# Altium schematic sheet [02] Arduino.SchDoc: Arduino Uno socket
size B; Engineer: M. Folejewski; DocumentNumber: 2; SheetNumber: 2; SheetTotal: 2; Designators: 1-99; PageSize: B
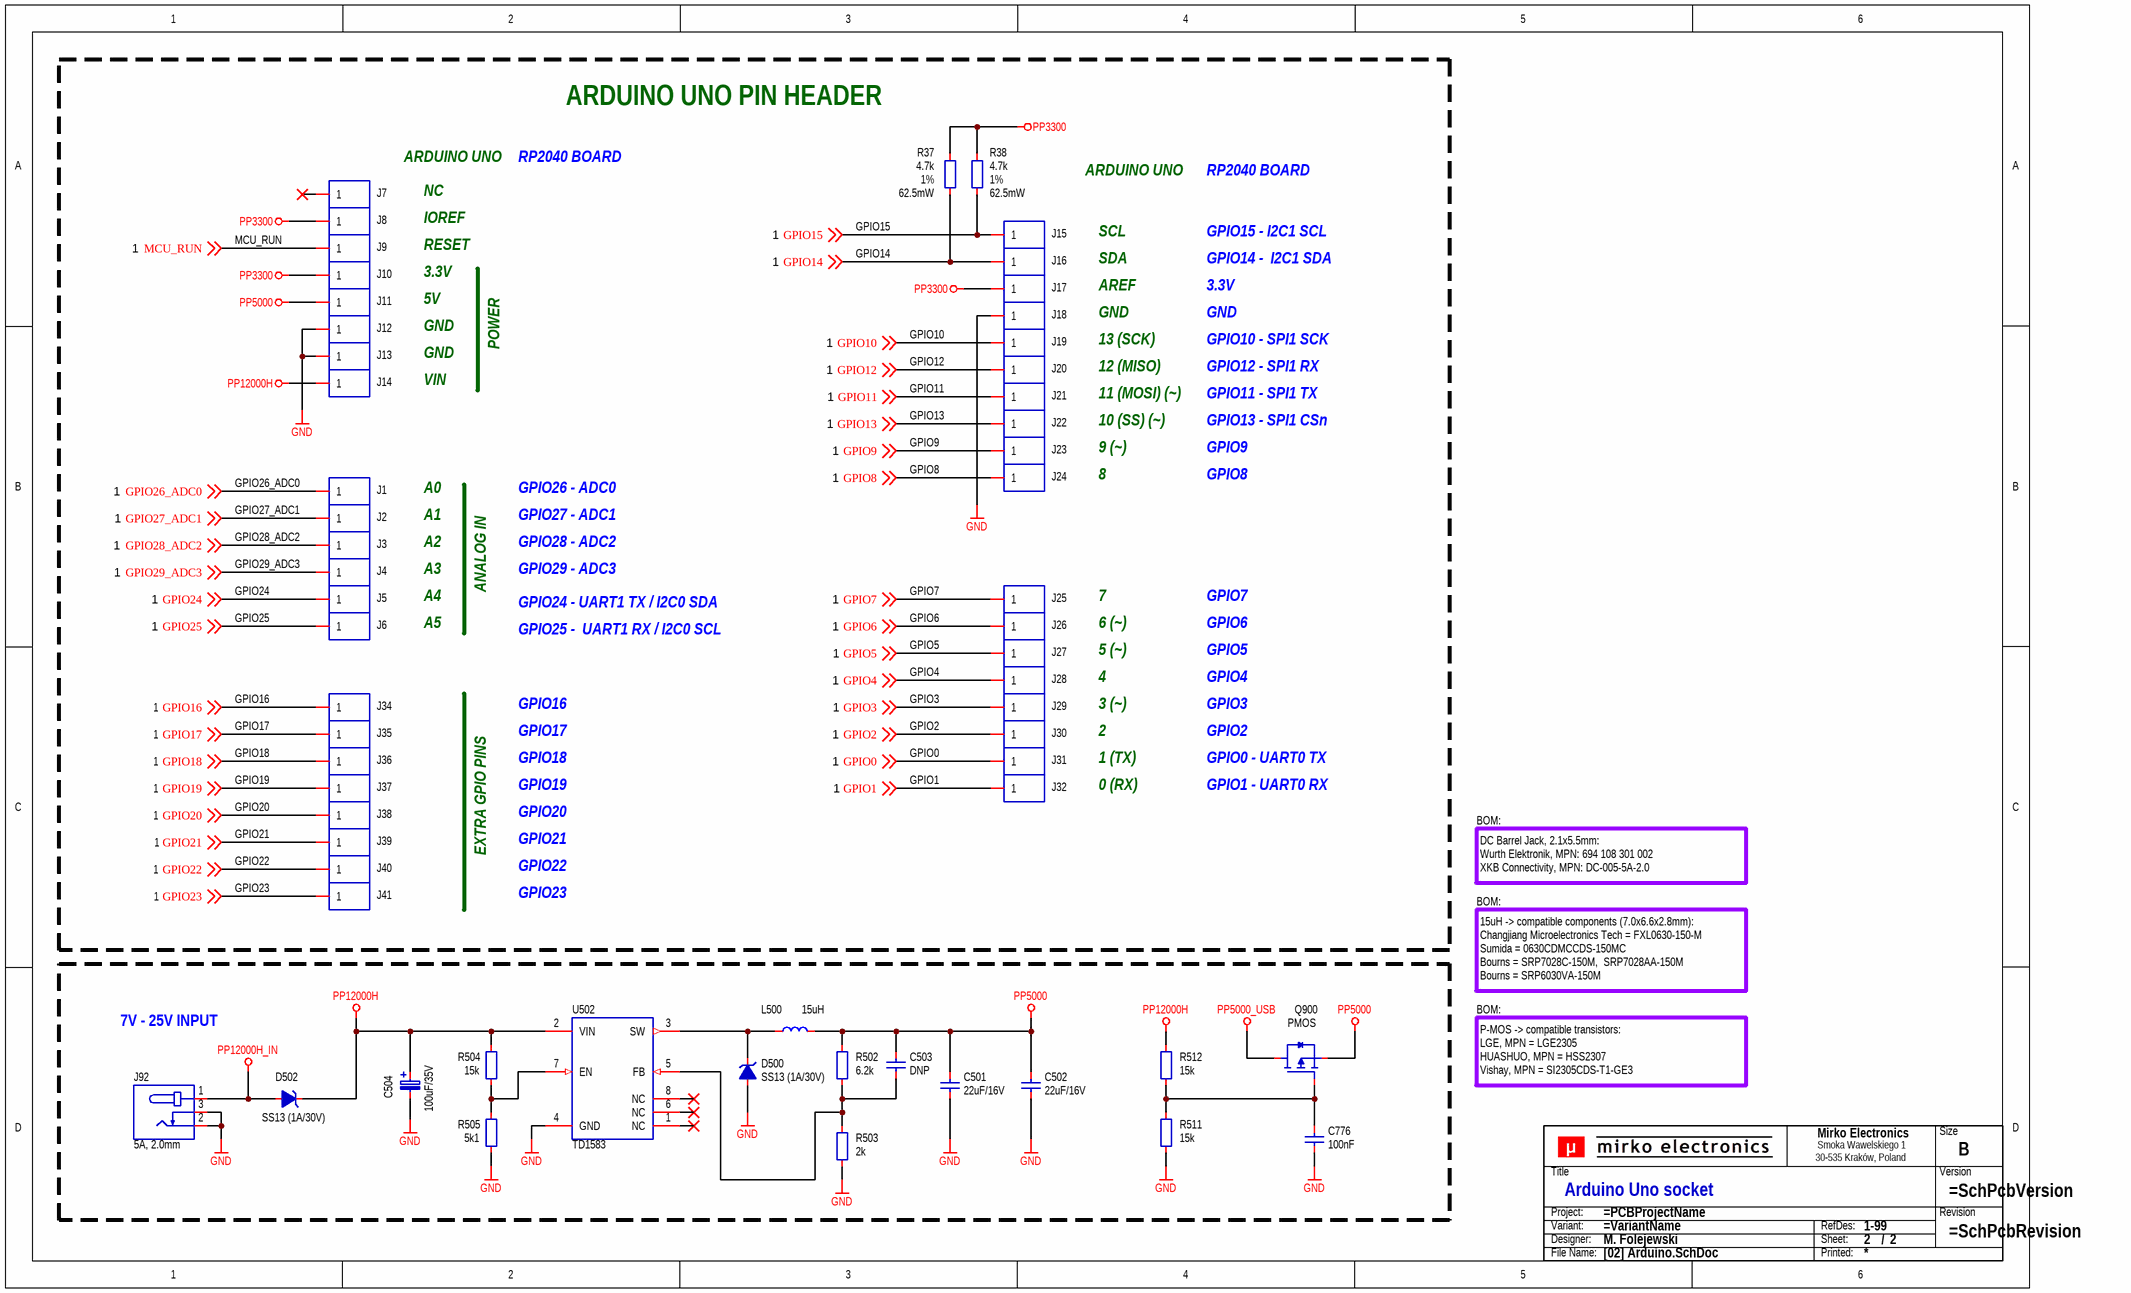
[diagram p0: [02] Arduino.SchDoc]

## Parts
C501  22uF/16V  [CAP_0805_R]
C502  22uF/16V  [CAP_0805_R]
C503  DNP  [CAP_0603_R]
C504  100uF/35V  [CAP_SMD_SIZE_D8]
C776  100nF  [CAP_0603_R]
D500  SS13 (1A/30V)  [DIO_SMA_UNI_R]
D502  SS13 (1A/30V)  [DIO_SMA_UNI_R]
J1  (no value)  [PCB_PAD_THT_280X180H100_RND]  (no BOM)
J2  (no value)  [PCB_PAD_THT_280X180H100_RND]  (no BOM)
J3  (no value)  [PCB_PAD_THT_280X180H100_RND]  (no BOM)
J4  (no value)  [PCB_PAD_THT_280X180H100_RND]  (no BOM)
J5  (no value)  [PCB_PAD_THT_280X180H100_RND]  (no BOM)
J6  (no value)  [PCB_PAD_THT_280X180H100_RND]  (no BOM)
J7  (no value)  [PCB_PAD_THT_280X180H100_RND]  (no BOM)
J8  (no value)  [PCB_PAD_THT_280X180H100_RND]  (no BOM)
J9  (no value)  [PCB_PAD_THT_280X180H100_RND]  (no BOM)
J10  (no value)  [PCB_PAD_THT_280X180H100_RND]  (no BOM)
J11  (no value)  [PCB_PAD_THT_280X180H100_RND]  (no BOM)
J12  (no value)  [PCB_PAD_THT_280X180H100_RND]  (no BOM)
J13  (no value)  [PCB_PAD_THT_280X180H100_RND]  (no BOM)
J14  (no value)  [PCB_PAD_THT_280X180H100_RND]  (no BOM)
J15  (no value)  [PCB_PAD_THT_280X180H100_RND]  (no BOM)
J16  (no value)  [PCB_PAD_THT_280X180H100_RND]  (no BOM)
J17  (no value)  [PCB_PAD_THT_280X180H100_RND]  (no BOM)
J18  (no value)  [PCB_PAD_THT_280X180H100_RND]  (no BOM)
J19  (no value)  [PCB_PAD_THT_280X180H100_RND]  (no BOM)
J20  (no value)  [PCB_PAD_THT_280X180H100_RND]  (no BOM)
J21  (no value)  [PCB_PAD_THT_280X180H100_RND]  (no BOM)
J22  (no value)  [PCB_PAD_THT_280X180H100_RND]  (no BOM)
J23  (no value)  [PCB_PAD_THT_280X180H100_RND]  (no BOM)
J24  (no value)  [PCB_PAD_THT_280X180H100_RND]  (no BOM)
J25  (no value)  [PCB_PAD_THT_280X180H100_RND]  (no BOM)
J26  (no value)  [PCB_PAD_THT_280X180H100_RND]  (no BOM)
J27  (no value)  [PCB_PAD_THT_280X180H100_RND]  (no BOM)
J28  (no value)  [PCB_PAD_THT_280X180H100_RND]  (no BOM)
J29  (no value)  [PCB_PAD_THT_280X180H100_RND]  (no BOM)
J30  (no value)  [PCB_PAD_THT_280X180H100_RND]  (no BOM)
J31  (no value)  [PCB_PAD_THT_280X180H100_RND]  (no BOM)
J32  (no value)  [PCB_PAD_THT_280X180H100_RND]  (no BOM)
J34  (no value)  [PCB_PAD_THT_280X180H100_RND]  (no BOM)
J35  (no value)  [PCB_PAD_THT_280X180H100_RND]  (no BOM)
J36  (no value)  [PCB_PAD_THT_280X180H100_RND]  (no BOM)
J37  (no value)  [PCB_PAD_THT_280X180H100_RND]  (no BOM)
J38  (no value)  [PCB_PAD_THT_280X180H100_RND]  (no BOM)
J39  (no value)  [PCB_PAD_THT_280X180H100_RND]  (no BOM)
J40  (no value)  [PCB_PAD_THT_280X180H100_RND]  (no BOM)
J41  (no value)  [PCB_PAD_THT_280X180H100_RND]  (no BOM)
J92  5A, 2.0mm  [CON_WRT_694108301002]
L500  15uH  [IND_SUM_0630CDMCCDS_700X660X280_R]
Q900  PMOS  [PKG_SOT23-3_TO236]
R37  4.7k  Tolerance: 1%  Power Rating: 62.5mW  [RES_0402_R]
R38  4.7k  Tolerance: 1%  Power Rating: 62.5mW  [RES_0402_R]
R502  6.2k  [RES_0603_R]
R503  2k  [RES_0603_R]
R504  15k  [RES_0603_R]
R505  5k1  [RES_0603_R]
R511  15k  [RES_0603_R]
R512  15k  [RES_0603_R]
TB?  Title block  (value not drawn)  (graphical)
U502  TD1583  [ICC_SO8_SOP8_490X390X160_P127_R]

## Blocks framed on the sheet
ARDUINO UNO PIN HEADER: J1-J32 J34-J41 R37 R38
7V - 25V INPUT: C501-C504 C776 D500 D502 J92 L500 Q900 R502-R505 R511 R512 U502

## Nets
GND: C501.1 C502.1 C504.1 C776.1 D500.2(A) J12.1 J13.1 J18.1 J92.2 J92.3 R503.2 R505.2 R511.1 U502.4(GND)
PP3300: J8.1 J10.1 J17.1 R37.2 R38.2
PP5000: C501.2 C502.2 C503.2 J11.1 L500.2 Q900.2(S) R502.2
PP5000_USB: Q900.3(D)
PP12000H: C504.2 D502.1(K) J14.1 R504.2 R512.2 U502.2(VIN)
PP12000H_IN: D502.2(A) J92.1
GPIO0: J31.1 ; off-sheet GPIO0
GPIO1: J32.1 ; off-sheet GPIO1
GPIO2: J30.1 ; off-sheet GPIO2
GPIO3: J29.1 ; off-sheet GPIO3
GPIO4: J28.1 ; off-sheet GPIO4
GPIO5: J27.1 ; off-sheet GPIO5
GPIO6: J26.1 ; off-sheet GPIO6
GPIO7: J25.1 ; off-sheet GPIO7
GPIO8: J24.1 ; off-sheet GPIO8
GPIO9: J23.1 ; off-sheet GPIO9
GPIO10: J19.1 ; off-sheet GPIO10
GPIO11: J21.1 ; off-sheet GPIO11
GPIO12: J20.1 ; off-sheet GPIO12
GPIO13: J22.1 ; off-sheet GPIO13
GPIO14: J16.1 R37.1 ; off-sheet GPIO14
GPIO15: J15.1 R38.1 ; off-sheet GPIO15
GPIO16: J34.1 ; off-sheet GPIO16
GPIO17: J35.1 ; off-sheet GPIO17
GPIO18: J36.1 ; off-sheet GPIO18
GPIO19: J37.1 ; off-sheet GPIO19
GPIO20: J38.1 ; off-sheet GPIO20
GPIO21: J39.1 ; off-sheet GPIO21
GPIO22: J40.1 ; off-sheet GPIO22
GPIO23: J41.1 ; off-sheet GPIO23
GPIO24: J5.1 ; off-sheet GPIO24
GPIO25: J6.1 ; off-sheet GPIO25
GPIO26_ADC0: J1.1 ; off-sheet GPIO26_ADC0
GPIO27_ADC1: J2.1 ; off-sheet GPIO27_ADC1
GPIO28_ADC2: J3.1 ; off-sheet GPIO28_ADC2
GPIO29_ADC3: J4.1 ; off-sheet GPIO29_ADC3
MCU_RUN: J9.1 ; off-sheet MCU_RUN
NetC503_1: C503.1 R502.1 R503.1 U502.5(FB)
NetC776_2: C776.2 Q900.1(G) R511.2 R512.1
NetD500_1: D500.1(K) L500.1 U502.3(SW)
NetR504_1: R504.1 R505.1 U502.7(EN)

Not connected (* = marked no-connect by the designer): J7 1*; U502 1(NC)* 6(NC)* 8(NC)*

## Notes on the sheet
- ARDUINO UNO
- RP2040 BOARD
- NC
- IOREF
- SCL
- GPIO15 - I2C1 SCL
- RESET
- 3.3V
- SDA
- AREF
- GPIO14 -  I2C1 SDA
- 5V
- GND
- POWER
- 13 (SCK)
- 12 (MISO)
- GPIO10 - SPI1 SCK
- GPIO12 - SPI1 RX
- VIN
- 11 (MOSI) (~)
- 10 (SS) (~)
- GPIO11 - SPI1 TX
- GPIO13 - SPI1 CSn
- A0
- GPIO26 - ADC0
- 9 (~)
- 8
- GPIO9
- GPIO8
- A1
- A2
- GPIO27 - ADC1
- GPIO28 - ADC2
- A3
- A4
- A5
- ANALOG IN
- GPIO25 -  UART1 RX / I2C0 SCL
- GPIO24 - UART1 TX / I2C0 SDA
- GPIO29 - ADC3
- 6 (~)
- 7
- GPIO6
- GPIO7
- 5 (~)
- 4
- GPIO5
- GPIO4
- GPIO16
- GPIO17
- GPIO18
- 3 (~)
- 2
- 1 (TX)
- GPIO3
- GPIO2
- GPIO0 - UART0 TX
- GPIO19
- GPIO20
- 0 (RX)
- GPIO1 - UART0 RX
- BOM:
- EXTRA GPIO PINS
- GPIO21
- GPIO22
- GPIO23
- DC Barrel Jack, 2.1x5.5mm:
  Wurth Elektronik, MPN: 694 108 301 002
  XKB Connectivity, MPN: DC-005-5A-2.0
- 15uH -> compatible components (7.0x6.6x2.8mm):
  Changjiang Microelectronics Tech = FXL0630-150-M
  Sumida = 0630CDMCCDS-150MC
  Bourns = SRP7028C-150M,  SRP7028AA-150M
  Bourns = SRP6030VA-150M
- (near TB?) P-MOS -> compatible transistors:
  LGE, MPN = LGE2305
  HUASHUO, MPN = HSS2307
  Vishay, MPN = SI2305CDS-T1-GE3
- (in symbol SCH_TITLE_BLOCK_V1) Mirko Electronics; Size; Smoka Wawelskiego 1; 30-535 Kraków, Poland; Title; Version; Project:; Revision; Variant:; RefDes:; Designer:; Sheet:; /; File Name:; Printed:

## Library data of the parts
C501 C502 = CAP-0024: Capacitor; MLCC; GENERIC; TBD; TBD; TBD; TBD; SMD; 0805 (2012);; ID: CAP-0024; Component Type: Capacitor; Component Subtype: MLCC; Value: 22uF/16V; Manufacturer: GENERIC; MPN: GENERIC; Mounting Type: SMD; Package (Case): 0805 (2012); Component Body: TBD; Component Height: TBD; Packaging Type: TBD; ROHS Status: TBD; Operating Temperature: TBD; Capacitance: GENERIC; Voltage Rating: TBD; Dielectric: TBD; Tolerance: TBD; Features: TBD; Supplier: ?
C503 = CAP-0018: Capacitor; MLCC; DNP; TBD; TBD; TBD; DO NOT PLACE; SMD; 0603 (1608);; ID: CAP-0018; Component Type: Capacitor; Component Subtype: MLCC; Value: DNP; Manufacturer: DNP; MPN: DNP; Mounting Type: SMD; Package (Case): 0603 (1608); Component Body: TBD; Component Height: TBD; Packaging Type: TBD; ROHS Status: TBD; Operating Temperature: TBD; Capacitance: DNP; Voltage Rating: TBD; Dielectric: TBD; Tolerance: TBD; Features: DO NOT PLACE
C504 = CAP_POL_2P_NP: Capacitor; Polarized;; Manufacturer: Panasonic; MPN: EEE-TQV101XAP; Component Subtype: Electrolytic; Package (Case): SMD SIZE D8; Component Type: Capacitor; Mounting Type: SMD; Value: 100uF/35V
C776 = CAP-0008: Capacitor; MLCC; 100nF; TBD; TBD; TBD; TBD; SMD; 0603 (1608);; Component Type: Capacitor; Component Subtype: MLCC; Value: 100nF; Manufacturer: TBD; MPN: TBD; Mounting Type: SMD; Package (Case): 0603 (1608); Supplier: ?
D500 D502 = DIO_TVS_UNI_KA: Diode; Schottky; Unipolar;; Manufacturer: ON Semi; Component Subtype: TVS Diode; Package (Case): DO-214AC (SMA); Value: SS13 (1A/30V); MPN: SS13; Component Type: Diode; Mounting Type: SMD; Supplier: LCSC
J1-J32 J34-J41 = CON_1X01_COL: Connector; 1 Row;
  J34-J41: Supplier 1: LCSC; Supplier 2: Farnell; Supplier 3: Mouser
J92 = CON_XKB_DC-005-5A-2.0: Connector; DC Barrel Jack;; Manufacturer: XKB Connectivity; Package (Case): THT; Component Subtype: DC Barrel Jack; Component Type: Connector; Mounting Type: THT; MPN: DC-005-5A-2.0; Supplier: LCSC; Value: 5A, 2.0mm
L500 = IND: Inductor;; Manufacturer: Changjiang Microelectronics Tech; MPN: FXL0630-150-M; Component Subtype: Power Inductor; Package (Case): SMD; Value: 15uH; Component Type: Inductor; Mounting Type: SMD; Supplier: ?
Q900 = TRA_PMOS_GSD: Transistor; PMOS;; Manufacturer: Vishay; MPN: SI2305CDS-T1-GE3; Component Subtype: P-MOSFET; Value: PMOS; Component Type: Transistor; Mounting Type: SMD; Supplier: ?
R37 R38 = RES-0019: Resistor; Thick Film; 4.7k; 1%; 62.5mW; 100PPM; 50V; Standard; SMD; 0402 (1005);; Manufacturer: Yageo Corporation; MPN: RC0402FR-074K7L; Component Body: 1.00 x 0.50mm; Packaging Type: Tape & Reel; ID: RES-0019; Component Type: Resistor; Component Subtype: Thick Film; Value: 4.7k; Mounting Type: SMD; Package (Case): 0402 (1005); Component Height: 0.35mm; ROHS Status: RoHS Compliant; Operating Temperature: -55°C to +155°C; Resistance: 4.7k; TCR: 100PPM; Voltage Rating: 50V; Features: Standard; Supplier 1: LCSC; Supplier 2: Farnell; Supplier Part Number 1: C105871; Supplier Part Number 2: 9239316; Supplier 3: Mouser; Supplier Part Number 3: 603-RC0402FR-074K7L
R502 = RES-0054: Resistor; Thick Film; GENERIC; TBD; TBD; TBD; TBD; TBD; SMD; 0603 (1608);; Component Body: 1.60 x 0.80mm; Resistance: 20k; ID: RES-0054; Component Type: Resistor; Component Subtype: Thick Film; Value: 6.2k; Manufacturer: GENERIC; MPN: GENERIC; Mounting Type: SMD; Package (Case): 0603 (1608); Component Height: TBD; Packaging Type: TBD; ROHS Status: TBD; Operating Temperature: TBD; Tolerance: TBD; Power Rating: TBD; TCR: TBD; Voltage Rating: TBD; Features: TBD
R503 = RES-0033: Resistor; Thick Film; 2k2; 1%; 100mW; 100PPM; 75V; Standard; SMD; 0603 (1608);; Manufacturer: Yageo Corporation; MPN: TBD; Component Type: Resistor; Component Subtype: Thick Film; Value: 2k; Mounting Type: SMD; Package (Case): 0603 (1608); Supplier: ?
R504 R511 R512 = RES-0043: Resistor; Thick Film; 15k; 1%; 100mW; 100PPM; 75V; Standard; SMD; 0603 (1608);; Manufacturer: Yageo Corporation; MPN: TBD; Component Type: Resistor; Component Subtype: Thick Film; Value: 15k; Mounting Type: SMD; Package (Case): 0603 (1608); Supplier: ?
R505 = RES-0043: Resistor; Thick Film; 5k1; 1%; 100mW; 100PPM; 75V; Standard; SMD; 0603 (1608);; Manufacturer: Yageo Corporation; MPN: TBD; Component Type: Resistor; Component Subtype: Thick Film; Value: 5k1; Mounting Type: SMD; Package (Case): 0603 (1608); Supplier: ?
TB? = SCH_TITLE_BLOCK_V1: Component Type: Title block; Manufacturer: -; Mounting Type: Non component; MPN: -; Operating Temperature: -; Package: -; Specification: Title block; Value: Title block; Replacement: -; System: ?
U502 = ICC_TCH_TD1583_SOP8: IC; Buck regulator;; Manufacturer: Techcode Semicon; MPN: TD1583PR; Package (Case): SOP8; Specification: Buck converter, 380kHz, 3A, SOP-8 package; Component Type: IC; Mounting Type: SMD; Value: TD1583